# Altium schematic sheet Sheet1.SchDoc
size A4
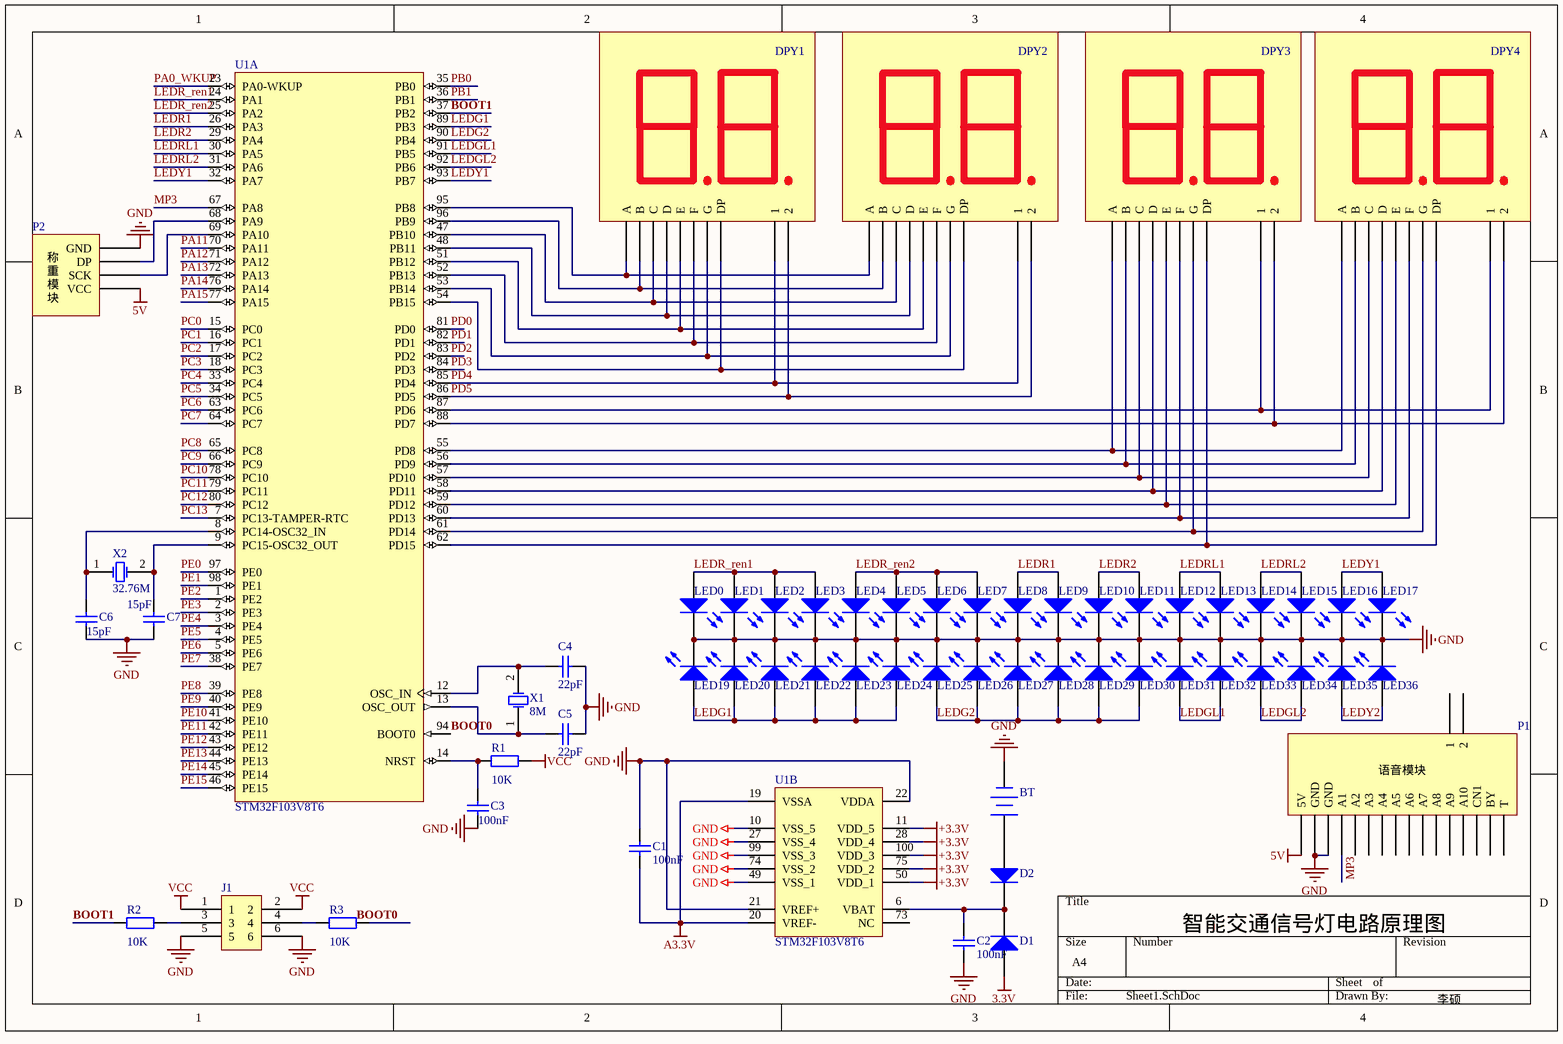
[diagram p0: Sheet1.SchDoc]

## Parts
BT  Battery  [BAT-2]  (value not drawn)
C1  value 100nF  [RAD-0.3]  (hidden comment: Cap)
C2  value 100nF  [RAD-0.3]  (hidden comment: Cap)
C3  value 100nF  [RAD-0.3]  (hidden comment: Cap)
C4  value 22pF  [RAD-0.3]  (hidden comment: Cap)
C5  value 22pF  [RAD-0.3]  (hidden comment: Cap)
C6  value 15pF  [RAD-0.3]  (hidden comment: Cap)
C7  value 15pF  [RAD-0.3]  (hidden comment: Cap)
D1  Diode  [DSO-C2/X3.3]  (value not drawn)
D2  Diode  [DSO-C2/X3.3]  (value not drawn)
DPY1  Component_1  (value not drawn)
DPY2  Component_1  (value not drawn)
DPY3  Component_1  (value not drawn)
DPY4  Component_1  (value not drawn)
J1  Component_1  (value not drawn)
LED0  LED0  [LED-0]  (value not drawn)
LED1  LED0  [LED-0]  (value not drawn)
LED2  LED0  [LED-0]  (value not drawn)
LED3  LED0  [LED-0]  (value not drawn)
LED4  LED0  [LED-0]  (value not drawn)
LED5  LED0  [LED-0]  (value not drawn)
LED6  LED0  [LED-0]  (value not drawn)
LED7  LED0  [LED-0]  (value not drawn)
LED8  LED0  [LED-0]  (value not drawn)
LED9  LED0  [LED-0]  (value not drawn)
LED10  LED0  [LED-0]  (value not drawn)
LED11  LED0  [LED-0]  (value not drawn)
LED12  LED0  [LED-0]  (value not drawn)
LED13  LED0  [LED-0]  (value not drawn)
LED14  LED0  [LED-0]  (value not drawn)
LED15  LED0  [LED-0]  (value not drawn)
LED16  LED0  [LED-0]  (value not drawn)
LED17  LED0  [LED-0]  (value not drawn)
LED19  LED0  [LED-0]  (value not drawn)
LED20  LED0  [LED-0]  (value not drawn)
LED21  LED0  [LED-0]  (value not drawn)
LED22  LED0  [LED-0]  (value not drawn)
LED23  LED0  [LED-0]  (value not drawn)
LED24  LED0  [LED-0]  (value not drawn)
LED25  LED0  [LED-0]  (value not drawn)
LED26  LED0  [LED-0]  (value not drawn)
LED27  LED0  [LED-0]  (value not drawn)
LED28  LED0  [LED-0]  (value not drawn)
LED29  LED0  [LED-0]  (value not drawn)
LED30  LED0  [LED-0]  (value not drawn)
LED31  LED0  [LED-0]  (value not drawn)
LED32  LED0  [LED-0]  (value not drawn)
LED33  LED0  [LED-0]  (value not drawn)
LED34  LED0  [LED-0]  (value not drawn)
LED35  LED0  [LED-0]  (value not drawn)
LED36  LED0  [LED-0]  (value not drawn)
P1  Component_2  (value not drawn)
P2  HX711AD  (value not drawn)
R1  value 10K  [AXIAL-0.4]  (hidden comment: Res2)
R2  value 10K  [AXIAL-0.4]  (hidden comment: Res2)
R3  value 10K  [AXIAL-0.4]  (hidden comment: Res2)
U1  STM32F103V8T6  [LQFP100_N]  (parts A,B of 2)
X1  8M  [BCY-W2/D3.1]
X2  32.76M  [BCY-W2/D3.1]

## Nets
3.3V: D1.1(A)
5V: P1.PVIN(5V) P2.PVIN(VCC)
+3.3V: U1.11(VDD_5) U1.28(VDD_4) U1.50(VDD_1) U1.75(VDD_2) U1.100(VDD_3)
A3.3V: C1.2 U1.19(VSSA) U1.20(VREF-)
GND: BT.2(-) C1.1 C2.2 C3.1 C4.1 C5.1 C6.1 C7.1 J1.5 J1.6 LED0.2(K) LED1.2(K) LED2.2(K) LED3.2(K) LED4.2(K) LED5.2(K) LED6.2(K) LED7.2(K) LED8.2(K) LED9.2(K) LED10.2(K) LED11.2(K) LED12.2(K) LED13.2(K) LED14.2(K) LED15.2(K) LED16.2(K) LED17.2(K) LED19.2(K) LED20.2(K) LED21.2(K) LED22.2(K) LED23.2(K) LED24.2(K) LED25.2(K) LED26.2(K) LED27.2(K) LED28.2(K) LED29.2(K) LED30.2(K) LED31.2(K) LED32.2(K) LED33.2(K) LED34.2(K) LED35.2(K) LED36.2(K) P1.PVIN(GND) P2.PVIN(GND) U1.10(VSS_5) U1.21(VREF+) U1.22(VDDA) U1.27(VSS_4) U1.49(VSS_1) U1.74(VSS_2) U1.99(VSS_3)
VCC: J1.1 J1.2 R1.2
BOOT0: U1.94(BOOT0)
BOOT1: R2.1 U1.37(PB2)
LEDG1: LED19.1(A) LED20.1(A) LED21.1(A) LED22.1(A) LED23.1(A) LED24.1(A) U1.89(PB3)
LEDG2: LED25.1(A) LED26.1(A) LED27.1(A) LED28.1(A) LED29.1(A) LED30.1(A) U1.90(PB4)
LEDGL1: LED31.1(A) LED32.1(A) U1.91(PB5)
LEDGL2: LED33.1(A) LED34.1(A) U1.92(PB6)
LEDR1: LED8.1(A) LED9.1(A) U1.26(PA3)
LEDR2: LED10.1(A) LED11.1(A) U1.29(PA4)
LEDR_ren1: LED0.1(A) LED1.1(A) LED2.1(A) LED3.1(A) U1.24(PA1)
LEDR_ren2: LED4.1(A) LED5.1(A) LED6.1(A) LED7.1(A) U1.25(PA2)
LEDRL1: LED12.1(A) LED13.1(A) U1.30(PA5)
LEDRL2: LED14.1(A) LED15.1(A) U1.31(PA6)
LEDY1: LED16.1(A) LED17.1(A) U1.32(PA7) U1.93(PB7)
LEDY2: LED35.1(A) LED36.1(A)
MP3: P1.PVIN(A1) U1.67(PA8)
PA0_WKUP: U1.23(PA0-WKUP)
PA11: U1.70(PA11)
PA12: U1.71(PA12)
PA13: U1.72(PA13)
PA14: U1.76(PA14)
PA15: U1.77(PA15)
PB0: U1.35(PB0)
PB1: U1.36(PB1)
PC0: U1.15(PC0)
PC1: U1.16(PC1)
PC2: U1.17(PC2)
PC3: U1.18(PC3)
PC4: U1.33(PC4)
PC5: U1.34(PC5)
PC6: U1.63(PC6)
PC7: U1.64(PC7)
PC8: U1.65(PC8)
PC9: U1.66(PC9)
PC10: U1.78(PC10)
PC11: U1.79(PC11)
PC12: U1.80(PC12)
PC13: U1.7(PC13-TAMPER-RTC)
PD0: U1.81(PD0)
PD1: U1.82(PD1)
PD2: U1.83(PD2)
PD3: U1.84(PD3)
PD4: DPY1.PVIN(1) DPY2.PVIN(1) U1.85(PD4)
PD5: DPY1.PVIN(2) DPY2.PVIN(2) U1.86(PD5)
PE0: U1.97(PE0)
PE1: U1.98(PE1)
PE2: U1.1(PE2)
PE3: U1.2(PE3)
PE4: U1.3(PE4)
PE5: U1.4(PE5)
PE6: U1.5(PE6)
PE7: U1.38(PE7)
PE8: U1.39(PE8)
PE9: U1.40(PE9)
PE10: U1.41(PE10)
PE11: U1.42(PE11)
PE12: U1.43(PE12)
PE13: U1.44(PE13)
PE14: U1.45(PE14)
PE15: U1.46(PE15)
NetBT_1: BT.1(+) D2.1(A)
NetC2_1: C2.1 D1.2(K) D2.2(K) U1.6(VBAT)
NetC3_2: C3.2 R1.1 U1.14(NRST)
NetC4_2: C4.2 U1.12(OSC_IN) X1.2(OSC2)
NetC5_2: C5.2 U1.13(OSC_OUT) X1.1(OSC1)
NetC6_2: C6.2 U1.8(PC14-OSC32_IN) X2.1(OSC1)
NetC7_2: C7.2 U1.9(PC15-OSC32_OUT) X2.2(OSC2)
NetDPY1_PVIN: DPY1.PVIN(A) DPY2.PVIN(A) U1.95(PB8)
NetDPY1_PVIN: DPY1.PVIN(B) DPY2.PVIN(B) U1.96(PB9)  [a separate net that carries the same name]
NetDPY1_PVIN: DPY1.PVIN(C) DPY2.PVIN(C) U1.47(PB10)  [a separate net that carries the same name]
NetDPY1_PVIN: DPY1.PVIN(D) DPY2.PVIN(D) U1.48(PB11)  [a separate net that carries the same name]
NetDPY1_PVIN: DPY1.PVIN(E) DPY2.PVIN(E) U1.51(PB12)  [a separate net that carries the same name]
NetDPY1_PVIN: DPY1.PVIN(F) DPY2.PVIN(F) U1.52(PB13)  [a separate net that carries the same name]
NetDPY1_PVIN: DPY1.PVIN(G) DPY2.PVIN(G) U1.53(PB14)  [a separate net that carries the same name]
NetDPY1_PVIN: DPY1.PVIN(DP) DPY2.PVIN(DP) U1.54(PB15)  [a separate net that carries the same name]
NetDPY3_PVIN: DPY3.PVIN(1) DPY4.PVIN(1) U1.87(PD6)
NetDPY3_PVIN: DPY3.PVIN(2) DPY4.PVIN(2) U1.88(PD7)  [a separate net that carries the same name]
NetDPY3_PVIN: DPY3.PVIN(A) DPY4.PVIN(A) U1.55(PD8)  [a separate net that carries the same name]
NetDPY3_PVIN: DPY3.PVIN(B) DPY4.PVIN(B) U1.56(PD9)  [a separate net that carries the same name]
NetDPY3_PVIN: DPY3.PVIN(C) DPY4.PVIN(C) U1.57(PD10)  [a separate net that carries the same name]
NetDPY3_PVIN: DPY3.PVIN(D) DPY4.PVIN(D) U1.58(PD11)  [a separate net that carries the same name]
NetDPY3_PVIN: DPY3.PVIN(E) DPY4.PVIN(E) U1.59(PD12)  [a separate net that carries the same name]
NetDPY3_PVIN: DPY3.PVIN(F) DPY4.PVIN(F) U1.60(PD13)  [a separate net that carries the same name]
NetDPY3_PVIN: DPY3.PVIN(G) DPY4.PVIN(G) U1.61(PD14)  [a separate net that carries the same name]
NetDPY3_PVIN: DPY3.PVIN(DP) DPY4.PVIN(DP) U1.62(PD15)  [a separate net that carries the same name]
NetJ1_3: J1.3 R2.2
NetJ1_4: J1.4 R3.1
NetP2_PVIN: P2.PVIN(DP) U1.68(PA9)
NetP2_PVIN: P2.PVIN(SCK) U1.69(PA10)  [a separate net that carries the same name]

Not connected (* = marked no-connect by the designer): R3 2; U1 73(NC)

## Notes on the sheet
- 智能交通信号灯电路原理图
- 李硕
- Labels drawn without touching a wire or pin: BOOT0
- (in symbol Component_2) 语音模块
- (in symbol Component_3) 称重模块 /

## Library data of the parts
BT = Battery: Multicell Battery; Published: 24-Mar-1999; LatestRevisionDate: 17-Jul-2002; LatestRevisionNote: Re-released for DXP Platform.; PackageReference: BAT-2; Publisher: Altium Limited
C1-C7 = Cap: Capacitor; Published: 8-Jun-2000; LatestRevisionDate: 17-Jul-2002; LatestRevisionNote: Re-released for DXP Platform.; PackageReference: RAD-0.3; Publisher: Altium Limited
D1 D2 = Diode: Default Diode; Published: 8-Jun-2000; LatestRevisionDate: 17-Jul-2002; LatestRevisionNote: Re-released for DXP Platform.; PackageVersion: Sep-1996; PackageReference: SMC; Publisher: Altium Limited; Code_JEDEC: DO-214-AB
LED0-LED17 LED19-LED36 = LED0: Typical INFRARED GaAs LED; Published: 8-Jun-2000; LatestRevisionDate: 08-Jul-2005; LatestRevisionNote: Mech Layer 1 removed.; PackageReference: LED-0; Publisher: Altium Limited
P2 = Component_3
R1-R3 = Res2: Resistor; Published: 8-Jun-2000; LatestRevisionDate: 17-Jul-2002; LatestRevisionNote: Re-released for DXP Platform.; PackageReference: AXIAL-0.4; Publisher: Altium Limited
U1 = STM32F103V8T6: STM32 ARM-based 32-bit MCU Performance Line with 64 kB Flash, 20 kB Internal RAM, -40 to +85°C Temperature, 100-Pin LQFP, Tray; DatasheetVersion: rev13.0, Apr-2011; PackageVersion: rev13, Apr-2011; PackageReference: LQFP100; PackageDescription: 100-Pin Low-Profile Quad Flat Pack, 14 x 14 mm Body, 0.5 mm Pitch (LQFP100); ComponentLink1Description: Manufacturer URL; ComponentLink1URL: http://www.st.com/; ComponentLink2Description: STM32F103 Datasheet; ComponentLink2URL: http://www.st.com/internet/com/TECHNICAL_RESOURCES/TECHNICAL_LITERATURE/DATASHEET/CD00161566.pdf; ComponentLink3Description: STM32 Family Web Page; ComponentLink3URL: www.st.com/stm32
X1 X2 = XTAL: Crystal Oscillator; Published: 8-Jun-2000; LatestRevisionDate: 17-Jul-2002; LatestRevisionNote: Re-released for DXP Platform.; PackageReference: R38; Publisher: Altium Limited